# EAGLE design pixel8 (EAGLE 7.7.0)
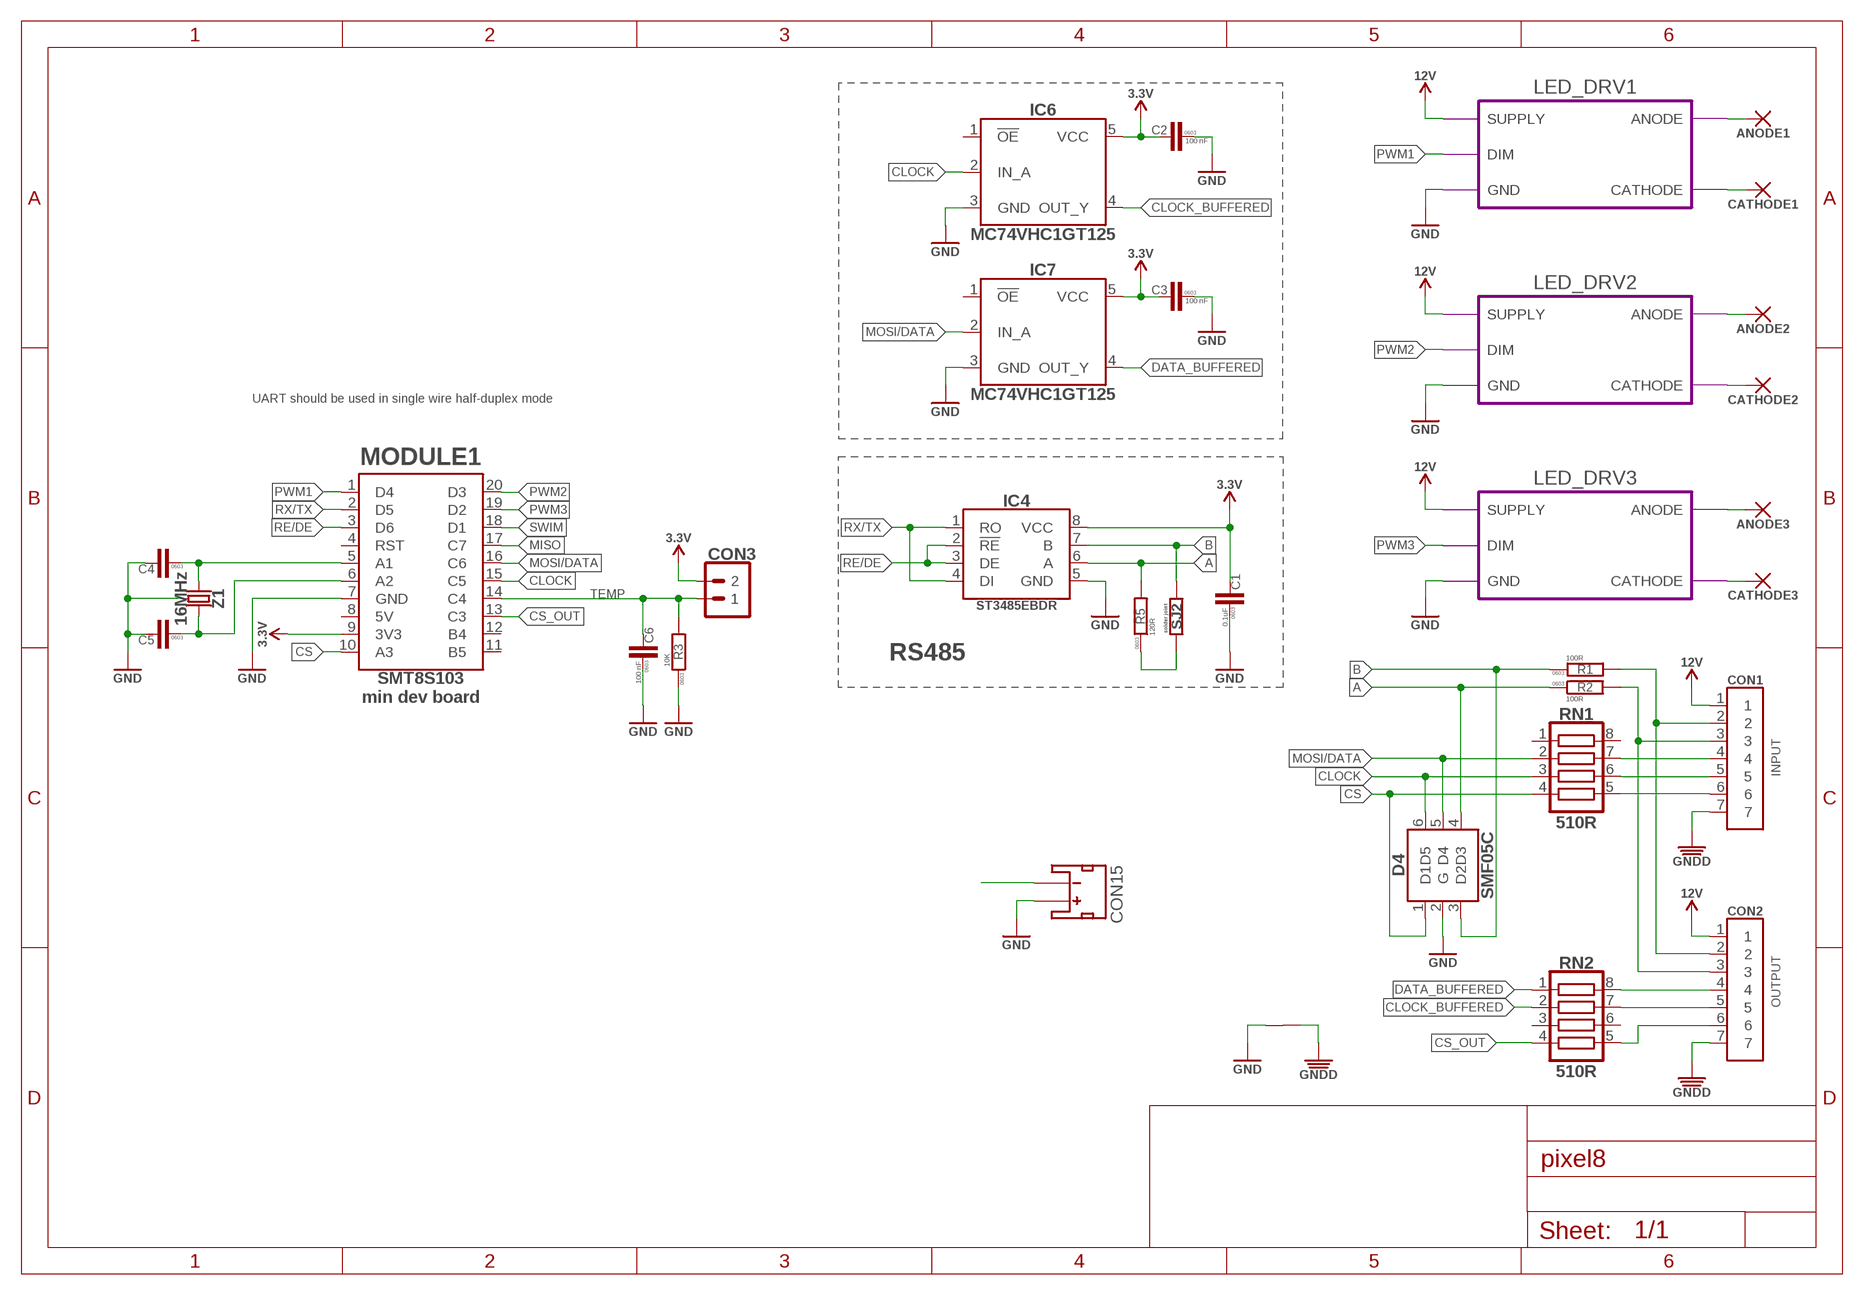
[diagram p0: schematic, sheet 1]

## Parts
ANODE1  WIREPADSMD5-2,5  [5-2,5]
ANODE2  WIREPADSMD5-2,5  [5-2,5]
ANODE3  WIREPADSMD5-2,5  [5-2,5]
C1  0.1uF  C-0603  [C0603]
C2  100 nF  C-0603  [C0603]
C3  100 nF  C-0603  [C0603]
C4  C-0603  [C0603]
C5  C-0603  [C0603]
C6  100 nF  C-0603  [C0603]
CATHODE1  WIREPADSMD5-2,5  [5-2,5]
CATHODE2  WIREPADSMD5-2,5  [5-2,5]
CATHODE3  WIREPADSMD5-2,5  [5-2,5]
CON1  DS1066-07M-SIDE  [DS1066-08M_SIDE]
CON2  DS1066-07M-SIDE  [DS1066-08M_SIDE]
CON3  PINHEAD_1X02-2.54  [1X02-PTH-2.54]
CON15  B2B-PH-K-S  [B2B-PH-K-S_SIDE_MOUNT]
D4  SMF05C  [SC70_6L]
IC4  ST3485SOIC8  [SOIC8]
IC6  MC74VHC1GT125  [SOT23-5]
IC7  MC74VHC1GT125  [SOT23-5]
MODULE1  STM8S_MIN_DEV_BOARD  [STM8_MIN_DEV_BOARD]
R1  100R  R-0603  [R0603]
R2  100R  R-0603  [R0603]
R3  10K  R-0603  [R0603]
R5  120R  R-0603  [R0603]
RN1  510R  RESISTOR_ARRAY  [CAT16-J4]
RN2  510R  RESISTOR_ARRAY  [CAT16-J4]
SJ2  SOLDER_JOINT  [RES_0]
U$6  CONNECTION  [CONNECTION]
Z1  16MHz  CRYSTAL-3.2X2.5-4P  [OSCILLATOR-3.2X2.5]

## Module instances
LED_DRV1 = PT4115 (part numbers offset by 100)
LED_DRV2 = PT4115 (part numbers offset by 200)
LED_DRV3 = PT4115 (part numbers offset by 300)

## Nets
A: D4.4(D3) IC4.6(A) R2.1 R5.2
A1: ANODE1.1(P) ; port LED_DRV1.ANODE
A2: ANODE2.1(P) ; port LED_DRV2.ANODE
A3: ANODE3.1(P) ; port LED_DRV3.ANODE
B: D4.3(D2) IC4.7(B) R1.1 SJ2.1
C1: CATHODE1.1(P) ; port LED_DRV1.CATHODE
C2: CATHODE2.1(P) ; port LED_DRV2.CATHODE
C3: CATHODE3.1(P) ; port LED_DRV3.CATHODE
CLOCK: D4.6(D5) IC6.2(IN_A) MODULE1.15(C5) RN1.3
CLOCK_BUFFERED: IC6.4(OUT_Y) RN2.2
CS: D4.1(D1) MODULE1.10(A3) RN1.4
CS_OUT: MODULE1.13(C3) RN2.4
DATA_BUFFERED: IC7.4(OUT_Y) RN2.1
GND: C1.1 C2.1 C3.1 C4.2 C5.2 C6.1 CON15.1(+) D4.2(G) IC4.5(GND) IC6.3(GND) IC7.3(GND) MODULE1.7(GND) R3.1 U$6.P$2 Z1.2(GND) Z1.4(GND) ; port LED_DRV1.GND LED_DRV2.GND LED_DRV3.GND
GNDD: CON1.7 CON2.7 U$6.P$1
MISO: MODULE1.17(C7)
MOSI/DATA: D4.5(D4) IC7.2(IN_A) MODULE1.16(C6) RN1.2
N$1: CON2.4 RN2.8
N$3: CON2.6 RN2.5
N$5: R5.1 SJ2.2
N$6: C4.1 MODULE1.5(A1) Z1.1
N$9: C5.1 MODULE1.6(A2) Z1.3
N$11: CON1.4 RN1.7
N$12: CON1.5 RN1.6
N$13: CON1.6 RN1.5
N$15: CON2.5 RN2.7
PWM1: MODULE1.1(D4) ; port LED_DRV1.DIM
PWM2: MODULE1.20(D3) ; port LED_DRV2.DIM
PWM3: MODULE1.19(D2) ; port LED_DRV3.DIM
RE/DE: IC4.2(!RE) IC4.3(DE) MODULE1.3(D6)
RS485_A: CON1.2 CON2.2 R1.2
RS485_B: CON1.3 CON2.3 R2.2
RX/TX: IC4.1(RO) IC4.4(DI) MODULE1.2(D5)
SWIM: MODULE1.18(D1)
TEMP: C6.2 CON3.1 MODULE1.14(C4) R3.2
VDD_3V3: C1.2 C2.2 C3.2 CON3.2 IC4.8(VCC) IC6.5(VCC) IC7.5(VCC) MODULE1.9(3V3) ; supply symbol labelled 3.3V
VDD_12V: CON1.1 CON2.1 ; port LED_DRV1.SUPPLY LED_DRV2.SUPPLY LED_DRV3.SUPPLY ; supply symbol labelled 12V
VDD_24V: CON15.2(-)
Unconnected: IC6.1(!OE) IC7.1(!OE) MODULE1.4(RST) MODULE1.8(5V) MODULE1.11(B5) MODULE1.12(B4) RN1.1 RN1.8 RN2.3 RN2.6

## Notes on the sheet
- UART should be used in single wire half-duplex mode
- RS485
- INPUT
- OUTPUT

## Library data of the parts
ANODE1-ANODE3 CATHODE1-CATHODE3 = valenok_master_library:WIREPAD: Wire PAD connect wire on PCB
C1-C6 = rc:C; PACKAGE: 0603
CON1 CON2 = pixel_masterlib:DS1066-07M: https://lib.chipdip.ru/502/DOC001502873.pdf
CON3 = pinhead:PINHEAD_1X02: pinheader 2P
CON15 = led_matrix_master_lib:B2B-PH-K-S: CONN HEADER PH TOP 2POS 2MM
D4 = pixel_masterlib:SMF05C; DIGIKEY#: SMF05CCT-ND; MANF: Semtech Corporation; MANF#: SMF05C.TCT
IC4 = pixel_masterlib:ST3485: IC TXRX 3.3V RS485/422 8 SOIC; DIGIKEY#: 497-2080-1-ND; MANF: STMicroelectronics; MANF#: ST3485EBDR
IC6 IC7 = pixel_masterlib:MC74VHC1GT125: Buffer, Non-Inverting 1 Element 1 Bit per Element Push-Pull Output 5-TSOP; DIGIKEY#: MC74VHC1GT125DT1GOSDKR-ND; MANF: ON Semiconductor; MANF#: MC74VHC1GT125
MODULE1 = pixel_masterlib:STM8S_MIN_DEV_BOARD
R1-R3 R5 = rc:R; PACKAGE: 0603
RN1 RN2 = pixel_masterlib:RESISTOR_ARRAY: Chip Resistor Array 4 Single Resistor; DIGIKEY#: CAT16-511J4LF-ND; MANF: Bourns Inc; MANF#: CAT16-511J4LF
SJ2 = eth_conv_master_lib:SOLDER_JOINT
U$6 = usb2can_master_lib:CONNECTION; BOM: EXCLUDE
Z1 = watchdog_master_library:CRYSTAL: Smd Crystal; DIGIKEY#: 1253-1182-1-ND; MANF: AVX Corp/Kyocera Corp; MANF#: CX3225GB16000P0HPQCC

## Module PT4115
Ports: SUPPLY(pwr) GND(pwr) DIM(in) ANODE(pwr) CATHODE(pwr)
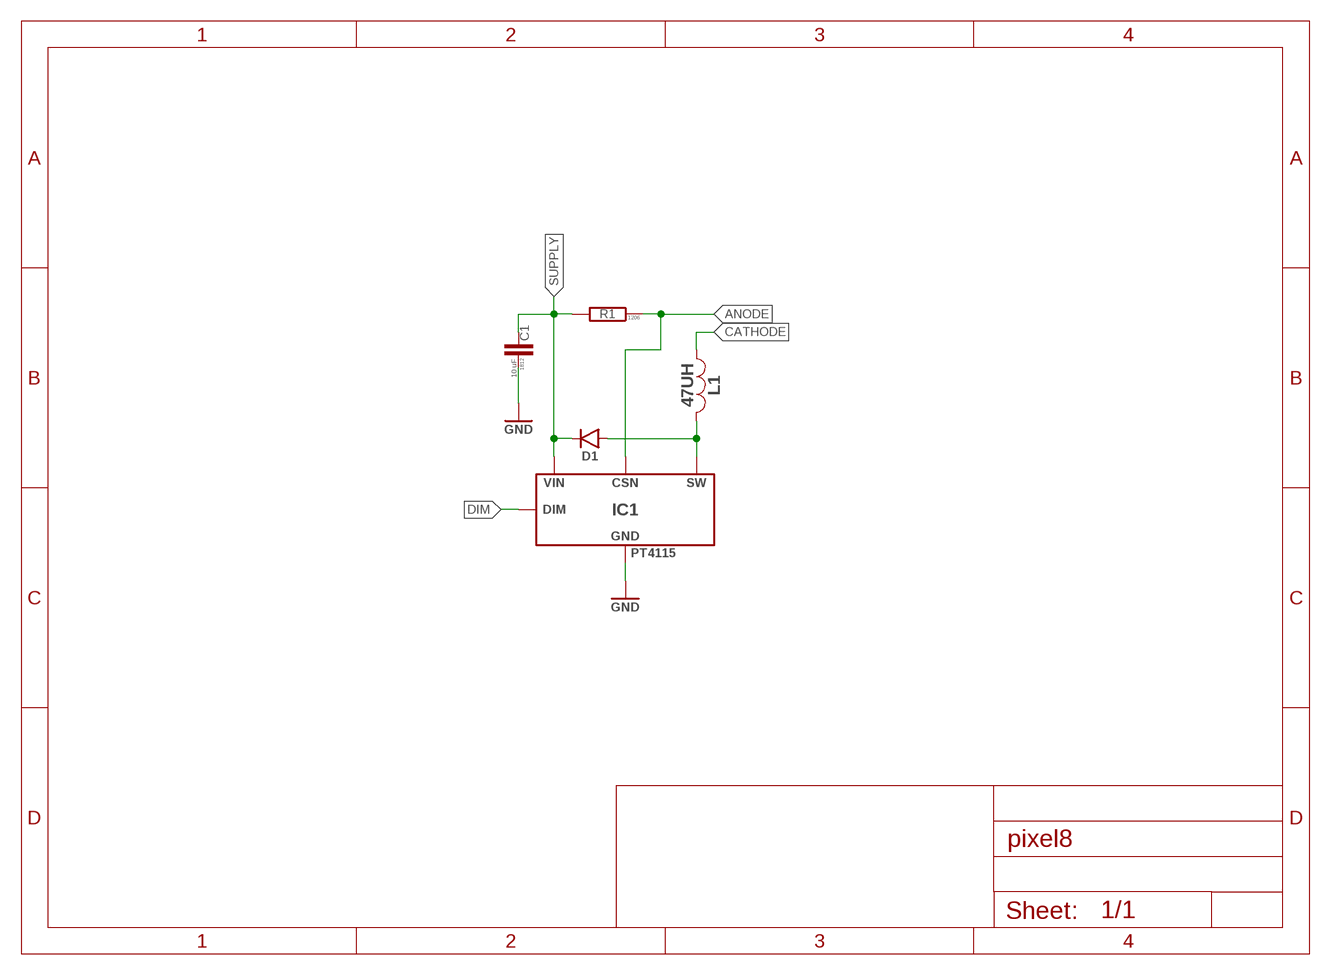
[diagram p1: schematic, module PT4115, sheet 1]

### Parts
C1  10 uF  C-1812  [C1812]
D1  CRS08-SOD123  [SOD123]
IC1  PT4115  [PT4115]
L1  47UH  INDUCTOR-470KL-SDR0805  [SDR0805]
R1  R-R1206  [R1206]

### Nets
ANODE: IC1.4(CSN) R1.P$1
CATHODE: L1.2
DIM: IC1.3(DIM)
GND: C1.P$1 IC1.2(GND) IC1.2A(GND)
SUPPLY: C1.P$2 D1.C IC1.5(VIN) R1.P$2
SW: D1.A IC1.1(SW) L1.1

### Library data of the parts
C1 = rc:C; PACKAGE: 1812
D1 = FMU_masterlib:CRS08; DIGIKEY#: CRS08QMCT-ND; MANF: Toshiba Semiconductor and Storage; MANF#: CRS08(TE85L,Q,M)
IC1 = pixel_masterlib:PT4115: 30V, 1.2A Step-down High Brightness LED Driver with 5000:1 Dimming PDF: http://www.google.pl/url?sa=t&rct=j&q=PT4115&source=web&cd=1&ved=0CC4QFjAA&url=http%3A%2F%2Fwww.micro-bridge.com%2Fdata%2FCRpowtech%2FPT4115E.pdf&ei=9NbxUKXPJNSzhAem2oGoAQ&usg=AFQjCNEsPWIIWjIVjxpF5YN6SPR3coTTpw&bvm=bv.1357700187,d.d2k
L1 = power_inductors:INDUCTOR; DIGIKEY#: SDR0805-470KLCT-ND; MANF: Bourns Inc; MANF#: SDR0805-470KL
R1 = rc:R; PACKAGE: 1206

## Board
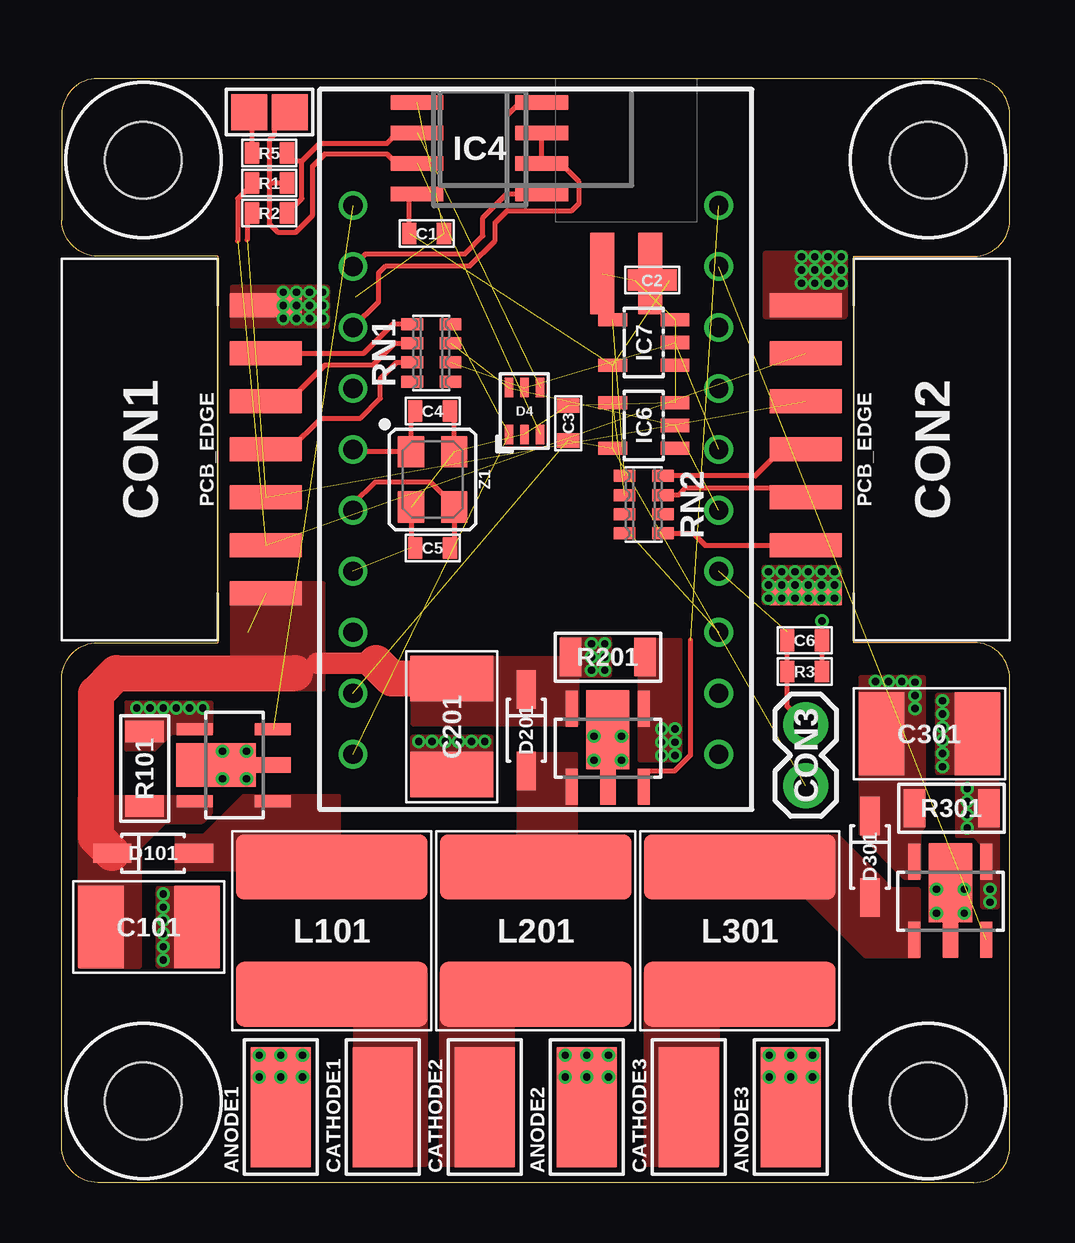
[diagram p2: board, top side]
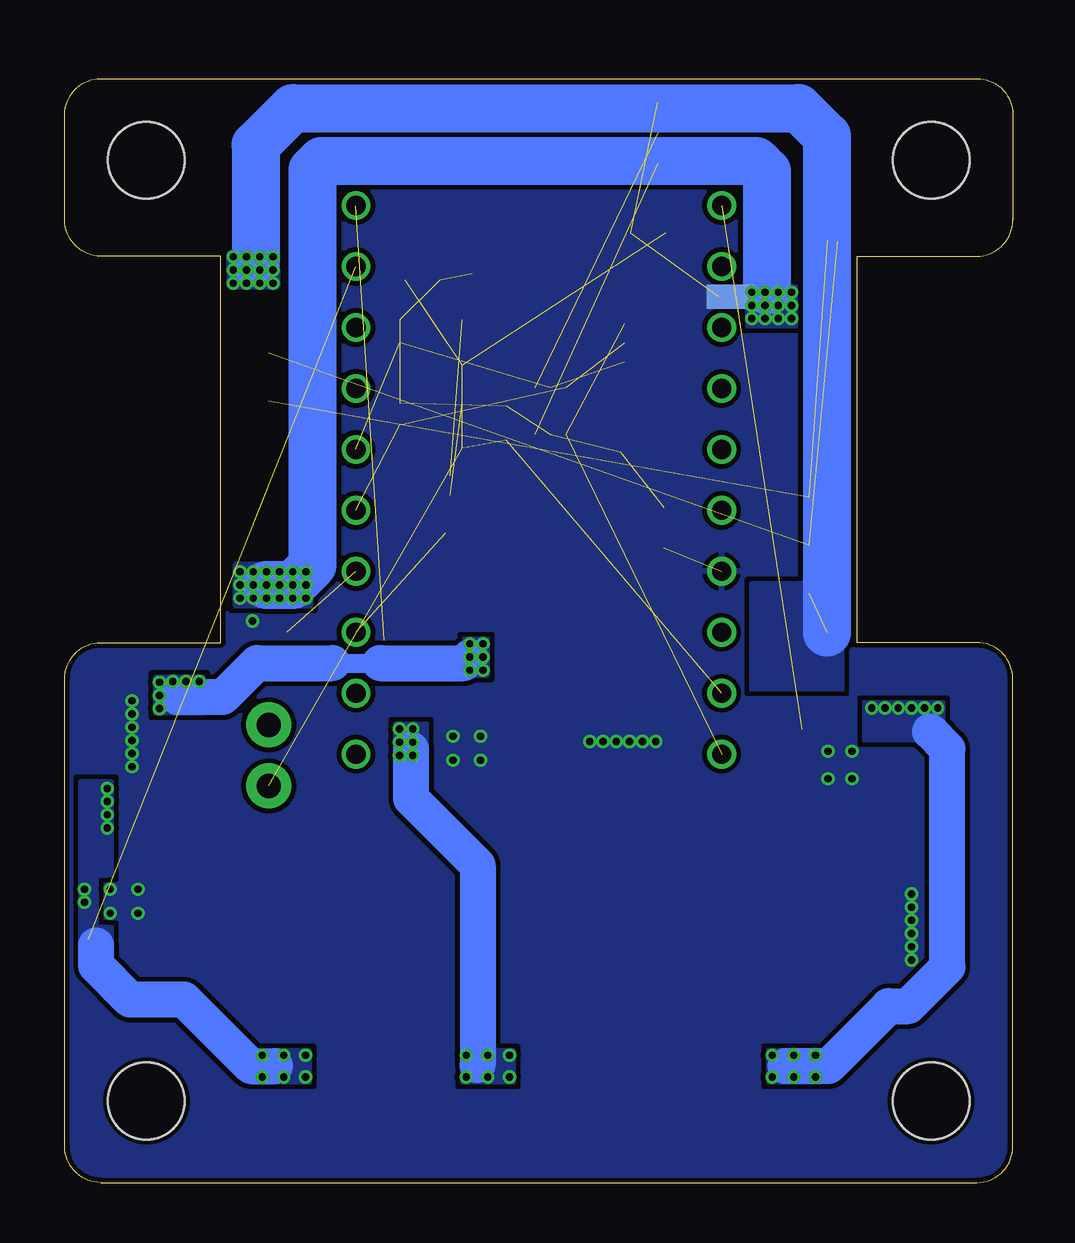
[diagram p3: board, bottom side, seen from below]

Size 39.5 x 46 mm. Coordinates in mm from the lower left corner, seen from the top.
Copper layers (1*16): Top 0.035mm / dielectric 0.5mm / Bottom 0.035mm
Design rules "design_rules *": minimum track width 0.2mm, minimum drill 0.2mm, track to track 0.2mm, track to pad 0.2mm, pad to pad 0.2mm, via to via 0.2mm, smd to smd 0.15mm, copper to edge 0.2mm, drill to drill 0.2mm, minimum pad ring 0.125mm, minimum via ring 0.125mm, stop-mask expansion 1mil, vias tented up to drill 0.31mm, thermal gap 8mil

### Footprints (pad centres in the part's own frame; a part is rotated, then mirrored left to right if it is on the bottom)
5-2,5 = smd 2.5 x 5: 1 0,0
C0603 = smd 0.6 x 0.9: 1 -0.725,0; 2 0.725,0
C1812 = smd 1.9 x 3.45: P$1 -2,0; P$2 2,0
DS1066-08M_SIDE = smd 1 x 3: 1 -6,-0.25; 2 -4,-0.25; 3 -2,-0.25; 4 0,-0.25; 5 2,-0.25; 6 4,-0.25; 7 6,-0.25
1X02-PTH-2.54 = drill 1.016 pad 1.88: 1 -1.27,0; 2 1.27,0
B2B-PH-K-S_SIDE_MOUNT = smd 1 x 3.4: 1 -1,-2.15; 2 1,-2.15
SC70_6L = smd 0.8 x 0.35: 1 -0.975,0.65; 2 -0.975,0; 3 -0.975,-0.65; 4 0.975,-0.65; 5 0.975,0; 6 0.975,0.65
SOD123 = smd 1.6 x 0.8: A 1.7,0; C -1.7,0
SOIC8 = smd 2.2 x 0.6: 1 -2.6,1.905; 2 -2.6,0.635; 3 -2.6,-0.635; 4 -2.6,-1.905; 5 2.6,-1.905; 6 2.6,-0.635; 7 2.6,0.635; 8 2.6,1.905
SOT23-5 = smd 0.55 x 1.2: 1 -0.95,-1.3; 2 0,-1.3; 3 0.95,-1.3; 4 0.95,1.3; 5 -0.95,1.3
PT4115 = smd 0.5 x 1.5: 1 -1.5,-1.6; 3 1.5,-1.6; 4 1.5,1.65; 5 -1.5,1.65 | smd 0.65 x 1.5: 2 0,-1.6 | smd 1.8 x 3.3: 2A 0,0.775
SDR0805 = smd 2.7 x 8: 1 -2.65,0; 2 2.65,0
STM8_MIN_DEV_BOARD = drill 0.8: 1 -7.62,10.16; 2 -7.62,7.62; 3 -7.62,5.08; 4 -7.62,2.54; 5 -7.62,0; 6 -7.62,-2.54; 7 -7.62,-5.08; 8 -7.62,-7.62; 9 -7.62,-10.16; 10 -7.62,-12.7; 11 7.62,-12.7; 12 7.62,-10.16; 13 7.62,-7.62; 14 7.62,-5.08; 15 7.62,-2.54; 16 7.62,0; 17 7.62,2.54; 18 7.62,5.08; 19 7.62,7.62; 20 7.62,10.16
R0603 = smd 0.6 x 0.9: 1 -0.725,0; 2 0.725,0
R1206 = smd 0.9 x 1.6: P$1 -1.55,0; P$2 1.55,0
CAT16-J4 = smd 0.5 x 0.9: 1 -1.2,-0.8; 2 -0.4,-0.8; 3 0.4,-0.8; 4 1.2,-0.8; 5 1.2,0.8; 6 0.4,0.8; 7 -0.4,0.8; 8 -1.2,0.8
RES_0 = smd 1.5 x 1.5: 1 -0.85,0; 2 0.85,0
MOUNTING_HOLE_M3 = hole 3.2: 0,0
CONNECTION = smd 1 x 1: P$1 -0.5,0; P$2 0.5,0
OSCILLATOR-3.2X2.5 = smd 1.3 x 1.1: 1 -1.15,-0.9; 2 1.15,-0.9; 3 1.15,0.9; 4 -1.15,0.9

### Placement (x,y rotation side)
ANODE1  9.12,3.15 0 top
ANODE2  21.88,3.15 0 top
ANODE3  30.38,3.15 0 top
C1  15.2,39.55 180 top
C2  24.6,37.6 0 top
C3  21.1,31.65 270 top
C4  15.45,32.15 0 top
C5  15.45,26.45 180 top
C6  30.95,22.6 180 top
C101  10 uF  [C1812]  3.62,10.65 180 top
C201  10 uF  [C1812]  16.25,19 90 top
C301  10 uF  [C1812]  36.15,18.7 180 top
CATHODE1  13.38,3.15 0 top
CATHODE2  17.62,3.15 0 top
CATHODE3  26.12,3.15 0 top
CON1  8.25,30.55 90 top
CON2  31.25,30.55 270 top
CON3  31,17.8 270 top
CON15  23.52,40.02 0 top
D4  19.27,32.15 90 top
D101  CRS08-SOD123  [SOD123]  3.8,13.72 0 top
D201  CRS08-SOD123  [SOD123]  19.35,18.85 270 top
D301  CRS08-SOD123  [SOD123]  33.67,13.57 270 top
IC4  17.4,43.1 180 top
IC6  24.25,31.55 90 top
IC7  24.25,35 90 top
IC101  [PT4115]  7.2,17.4 90 top
IC201  [PT4115]  22.75,18.1 0 top
IC301  [PT4115]  37.02,11.72 0 top
L101  47UH  [SDR0805]  11.25,10.5 270 top
L201  47UH  [SDR0805]  19.75,10.5 270 top
L301  47UH  [SDR0805]  28.25,10.5 270 top
MODULE1  19.75,30.55 0 top
R1  8.65,41.65 180 top
R2  8.65,40.4 180 top
R3  30.95,21.3 180 top
R5  8.65,42.9 0 top
R101  [R1206]  3.45,17.25 270 top
R201  [R1206]  22.75,21.9 180 top
R301  [R1206]  37.08,15.6 180 top
RN1  15.4,34.58 90 top
RN2  24.25,28.25 270 top
SJ2  8.65,44.6 180 top
U$1  [PIXEL8_BOARD_OUTLINE]  19.75,23 0 top
U$2  [MOUNTING_HOLE_M3]  3.4,3.4 0 top
U$3  [MOUNTING_HOLE_M3]  36.1,3.4 0 top
U$4  [MOUNTING_HOLE_M3]  36.1,42.6 0 top
U$5  [MOUNTING_HOLE_M3]  3.4,42.6 0 top
U$6  11.75,36.9 180 bottom
Z1  15.45,29.3 270 top

### Tracks (layer width: path | path; a pad name or v marks a point on that pad's centre or on a via)
A  (1 unrouted)
  Top 0.2: IC4.6 13.98,43.73 13.55,43.3 10.75,43.3 10,42.55 | R2.1 9.4,40.4 9.4,40.75 9.75,40.75 10,41 10,42.55 | R5.2 9.38,42.55 10,42.55
A1  (via drill 0.3)
  Top 0.2: ANODE1.1 v9.12,4.4
  Bottom 1.5: R101.P$1 2.73,18.07 2.73,8.97 4.35,7.35 5.18,7.35 7.68,4.85 9.47,4.85
  other vias: 4.22,19.77 3.12,19.77 3.68,19.77 4.78,19.77 5.32,19.77 5.88,19.77 9.12,5.3 8.22,5.3 10.03,5.3 10.03,4.4 8.22,4.4
  pour Top (no thermals): 6.2,18.75 4.55,18.75 3.85,18.05 2.73,18.05 2.73,20 6.2,20
  pour Bottom: 10.2,4.2 8.05,4.2 8.05,5.5 10.2,5.5
  pour Bottom: 6.2,18.45 2.9,18.45 2.9,20 6.2,20
A2  (via drill 0.3)
  Top 0.2: ANODE2.1 v21.88,4.4
  Bottom 1.5: 25.07,18.05 25.07,16 22.3,13.22 22.3,4.9
  other vias: 25.55,17.8 25.55,18.35 25.55,18.9 25,18.9 25,18.35 25,17.8 21.88,5.3 20.98,5.3 22.77,5.3 22.77,4.4 20.98,4.4
  pour Top (no thermals): 24.1,17.6 24.1,22.6 25.75,22.6 25.75,17.6
  pour Bottom: 22.95,4.2 20.8,4.2 20.8,5.5 22.95,5.5
  pour Bottom: 25.73,19.1 25.73,17.6 24.43,17.6 24.43,19.1
A3  (via drill 0.3)
  Top 0.2: ANODE3.1 v30.38,4.4
  Bottom 1.5: 30.75,4.85 31.75,4.85 34.52,7.62 36.77,7.62 38.2,9.05 38.2,9.88
  other vias: 30.38,5.3 29.48,5.3 31.27,5.3 31.27,4.4 29.48,4.4 37.73,16.43 38.67,12.22 38.67,11.68 37.73,15.88 37.73,15.32 37.73,14.78
  pour Bottom: 31.45,4.2 29.3,4.2 29.3,5.5 31.45,5.5
  pour Top (no thermals): 38.98,11.47 38.38,11.47 38.38,14.12 38.05,14.45 37.33,14.45 37.33,16.7 38.98,16.7
  pour Bottom (no thermals): 38.85,9.47 37.55,9.47 37.55,10.65 38.17,10.65 38.17,12.8 37.55,12.8 37.55,16.7 38.85,16.7
B  (1 unrouted)
  Top 0.2: SJ2.1 8.85,43.95 8.85,43.65 8.65,43.45 8.65,41.65 | 9.38,42 R1.1 8.65,41.65 | 8.65,41.65 8.65,39.95 9,39.6 9.75,39.6 10.45,40.3 10.45,42.35 10.95,42.85 13.55,42.85 13.93,42.47 IC4.7
C1
  pour Top (no thermals): 12.25,0.75 12.25,7 11.25,7 11.25,8.7 15.15,8.7 15.15,0.75
C2
  pour Top (no thermals): 15.8,0.75 15.82,7.03 15.82,8.72 20.25,8.72 20.25,7.5 18.77,7.53 18.77,0.75
C3
  pour Top (no thermals): 24.35,0.75 24.35,8.72 28.77,8.72 28.77,7.5 27.3,7.53 27.3,0.75
CLOCK  (3 unrouted)
CLOCK_BUFFERED  (1 unrouted)
CS  (2 unrouted)
CS_OUT  (1 unrouted)
  Top 0.2: RN2.4 23.65,27.05
DATA_BUFFERED  (1 unrouted)
GND  (via drill 0.3)  (10 unrouted)
  Top 0.2: IC301.2 IC301.2A | IC301.2A 36.7,12.82 | IC101.2 IC101.2A 6.7,17.68 v6.7,17.98 | C6.1 R3.1 v31.68,23.4 | Z1.2 14.55,26.45 C5.2 | Z1.4 16.35,32.15 C4.2 | IC201.2A 22.55,18.68 | IC201.2 IC201.2A | IC301.2A 36.75,12.22 v36.45,12.22 | v22.18,18.6 22.45,18.88 IC201.2A
  other vias: 14.88,18.38 15.43,18.38 15.97,18.38 16.52,18.38 17.07,18.38 17.62,18.38 4.22,9.28 4.22,9.82 4.22,10.38 4.22,10.93 4.22,11.47 4.22,12.03 36.7,17.32 36.7,17.88 36.7,18.43 36.7,18.98 36.7,19.52 36.7,20.07 6.7,16.82 7.7,17.98 7.7,16.82 37.6,12.22 37.6,11.22 36.45,11.22 22.18,17.6 23.32,17.6 23.32,18.6
  pour Bottom (rank 6): 0,0 0,46 39.5,46 39.5,0
  pour Top (no thermals): 17.88,16.32 14.62,16.32 14.62,18.57 17.88,18.57
  pour Top (no thermals): 6.28,12.28 6.28,9.03 4.03,9.03 4.03,12.28
  pour Top (no thermals): 38.75,20.32 38.75,17.07 36.5,17.07 36.5,20.32
GNDD  (via drill 0.3)
  Bottom 2: 10.25,37.17 10.25,42.12 10.7,42.58 28.8,42.58 29.18,42.2 29.18,25.73 v30,24.9 v31.1,24.9
  other vias: 29.45,25.45 30,25.45 30.55,25.45 31.1,25.45 31.65,25.45 32.2,25.45 29.45,24.9 30.55,24.9 31.65,24.9 32.2,24.9 29.45,24.35 30,24.35 30.55,24.35 31.1,24.35 31.65,24.35 32.2,24.35 10.32,37.1 10.88,37.1 9.22,37.1 9.78,37.1 9.78,36.55 9.22,36.55 10.88,36.55 10.32,36.55 10.32,36 10.88,36 9.22,36 9.78,36
  pour Top (no thermals): 32.35,24.2 29.3,24.2 29.3,25.6 32.35,25.6
  pour Top (no thermals): 7.1,37.3 7.1,35.7 11.07,35.7 11.07,37.3
  pour Bottom (no thermals): 11.07,37.3 11.07,35.7 7.1,35.7 7.1,37.3
  pour Bottom (no thermals): 29.3,24.05 32.35,24.05 32.35,25.75 29.3,25.75
LED_DRV1:SW
  pour Top (no thermals): 10.57,13.05 4.8,13.05 4.8,14.45 5.95,14.45 7.43,15.93 7.6,16.1 9.47,16.1 11.53,16.1 11.53,13.1 11.53,13.05
LED_DRV2:SW
  pour Top (no thermals): 21.4,17.85 21.4,12.75 19.05,12.75 19.05,17.85
LED_DRV3:SW
  pour Top (no thermals): 27.5,12.15 30.8,12.15 33.5,9.45 35.7,9.45 35.7,12.2 34.55,12.2 32.35,14.4 27.5,14.4
MOSI/DATA  (3 unrouted)
N$1
  Top 0.2: CON2.4 30,30.55 28.9,29.45 RN2.8
N$3
  Top 0.2: RN2.5 26.3,27.05 26.8,26.55 CON2.6
N$5
  Top 0.2: R5.1 7.93,44.6 SJ2.2
N$6
  Top 0.2: MODULE1.5 12.13,30.45 Z1.1 14.55,32.15 C4.1
N$9
  Top 0.2: MODULE1.6 12.13,28.28 13.05,29.2 15.35,29.2 16.3,28.25 Z1.3 16.35,26.45 C5.1
N$11
  Top 0.2: CON1.4 9.5,30.55 10.8,31.85 12.45,31.85 13.28,32.67 13.28,33.5 13.95,34.17 RN1.7
N$12
  Top 0.2: CON1.5 9.45,32.55 10.97,34.08 12.97,34.08 13.88,34.98 RN1.6
N$13
  Top 0.2: CON1.6 12.57,34.55 13.8,35.77 RN1.5
N$15
  Top 0.2: RN2.7 25.7,28.65 26,28.95 30.6,28.95 CON2.5
PWM1  (1 unrouted)
PWM2  (1 unrouted)
  Top 0.2: IC201.3 24.25,17.15 25.52,17.15 26.2,17.82 26.2,22.6
PWM3  (1 unrouted)
RE/DE
  Top 0.2: IC4.3 IC4.2 20.79,42.47 21.55,41.7 21.55,40.8 21.25,40.5 18.55,40.5 18.05,40 18.05,39.25 17,38.2 13.5,38.2 13.2,37.9 13.2,36.7 MODULE1.3
RS485_A  (2 unrouted)
  Top 0.2: R1.2 7.93,41.6 7.32,41 7.32,39.23
RS485_B  (2 unrouted)
  Top 0.2: R2.2 7.72,40.2 7.72,39.27
RX/TX
  Top 0.2: IC4.4 19.11,45 18.55,44.45 18.55,41.2 | MODULE1.2 12.66,38.7 16.8,38.7 17.55,39.45 17.55,40.2 18.55,41.2 | 18.55,41.2 IC4.1
TEMP  (1 unrouted)
  Top 0.2: CON3.1 30.23,19.84 R3.2 C6.2 30.23,22.95
VDD_3V3  (6 unrouted)
  Top 0.2: C1.2 14.47,41.2 IC4.8
VDD_12V  (via drill 0.3)  (1 unrouted)
  Top 0.9: 10.65,21.65 13.1,21.65
  Top 1.5: D101.C 1.43,14.4 1.43,20.38 2.27,21.23 9.72,21.23 | C201.P$2 13.75,21 13.1,21.65
  Bottom 0.8: 28.35,21.65 26.38,21.65
  Bottom 1.5: 28.35,21.65 31.5,21.65 32.92,20.23 34.8,20.23 | 26.38,21.65 22.88,21.65 v22.62,21.9
  Bottom 2: 7.75,22.93 7.75,43.6 8.93,44.77 30,44.77 31.55,43.23 31.55,38.33
  other vias: 35.55,19.75 35.55,20.3 35.55,20.85 35,20.88 34.45,20.88 33.9,20.88 22.07,22.45 22.07,21.9 22.07,21.35 22.62,21.35 22.62,22.45 30.82,37.48 31.38,37.48 31.93,37.48 32.48,37.48 32.48,38.02 31.93,38.02 31.38,38.02 30.82,38.02 30.82,38.58 31.38,38.58 31.93,38.58 32.48,38.58
  pour Top (no thermals): 21.45,19.1 14.65,19.1 14.65,21.85 21.45,21.85
  pour Top (no thermals): 3.23,9 0.77,9 0.77,16.05 6.18,16.05 6.18,15.4 5.8,15.03 4.25,15.03 3.23,14
  pour Top (no thermals): 35.7,12.7 35.15,12.7 33.3,14.55 33.3,21.05 35.9,21.05 35.9,14.85 35.7,14.65
  pour Top (no thermals): 7.1,24.95 7.1,20.57 10.9,20.57 10.9,24.95
  pour Bottom: 35.73,21.05 35.73,19.57 33.73,19.57 33.73,21.05
  pour Bottom: 21.88,22.65 22.85,22.65 22.85,21.15 21.88,21.15
  pour Top (no thermals): 22.82,22.65 20.85,22.65 20.85,21.15 22.82,21.15
  pour Top (no thermals): 32.6,36.1 29.35,36.1 29.35,38.7 32.6,38.7
  pour Bottom (no thermals): 30.68,37.35 32.6,37.35 32.62,38.7 30.7,38.7
  pour Bottom (no thermals): 10.9,24.95 10.9,20.57 7.1,20.57 7.1,24.95